# Altium schematic sheet 10_MountingHoles.SchDoc: MountingHoles
size A4; ApprovedBy: Alcatraz; CheckedBy: Alcatraz; Author: Alcatraz; CompanyName: DHNLAB; DrawnBy: Alcatraz; Engineer: Alcatraz; Organization: DHNLAB PVT LTD; Address1: DHANBAD; Address2: JHARKHAND; Address3: INDIA; Address4: ASIA; DocumentNumber: 10; Revision: 1.0; SheetNumber: 10; SheetTotal: 10; ProjectTitle: ESP8266-Deskop_Power
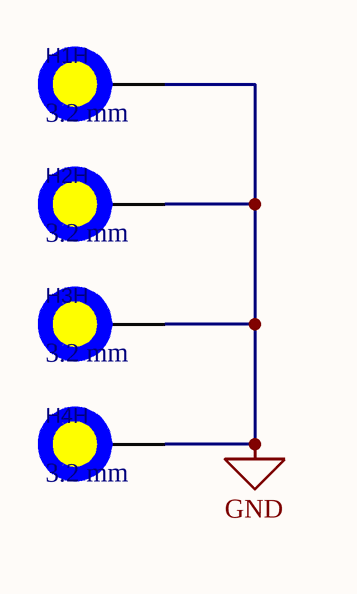
[diagram p0: 10_MountingHoles.SchDoc]

## Parts
H1H  3.2 mm  [MountingHole_3.2mm_M3_Pad_Via_Mask]
H2H  3.2 mm  [MountingHole_3.2mm_M3_Pad_Via_Mask]
H3H  3.2 mm  [MountingHole_3.2mm_M3_Pad_Via_Mask]
H4H  3.2 mm  [MountingHole_3.2mm_M3_Pad_Via_Mask]

## Nets
GND: H1H.1 H2H.1 H3H.1 H4H.1

## Notes on the sheet
- Title:
- Author:
- Approved:
- Size:
- Date:
- Git Hash:
- A4
- Prj:
- SW Version:
- Variant:
- Edited:
- PUBLIC
- File:

## Library data of the parts
H1H H2H H3H H4H = MountingHole_Pad_3.2mm: ki_description: Mounting Hole with connection; ki_fp_filters: MountingHole*Pad*; Supplier: ~; ki_keywords: mounting hole; Value: 3.2 mm